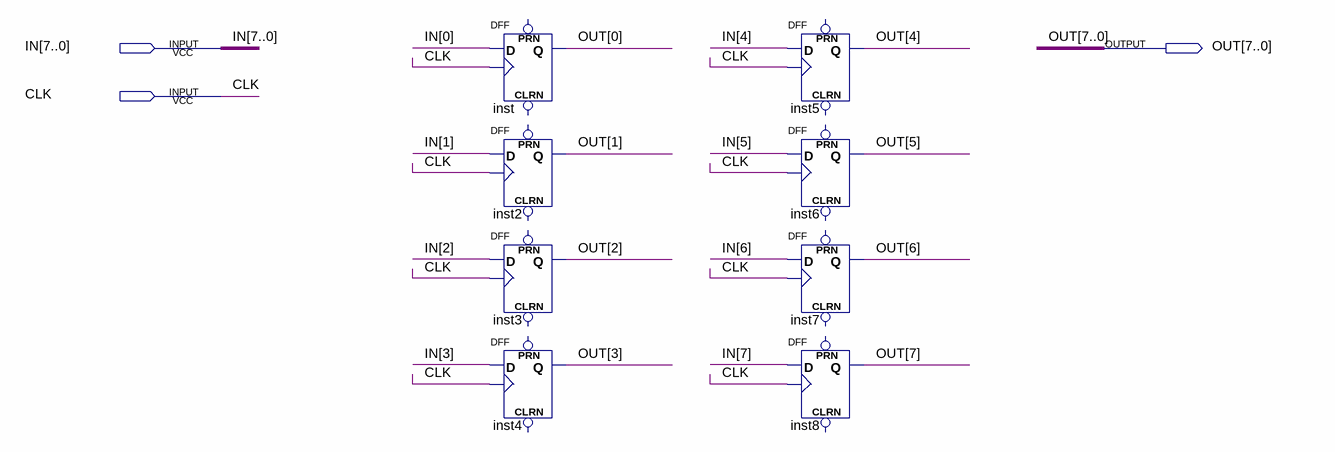
[diagram p0: schematic sheet]
// Quartus schematic reg8bit.bdf as structural Verilog: 8 symbols, 3 pins
module reg8bit (
  input  [7:0] IN,
  input  CLK,
  output [7:0] OUT
);

  DFF inst (.CLK(CLK), .D(IN[0]), .Q(OUT[0]));  // open: CLRN, PRN
  DFF inst2 (.CLK(CLK), .D(IN[1]), .Q(OUT[1]));  // open: CLRN, PRN
  DFF inst3 (.CLK(CLK), .D(IN[2]), .Q(OUT[2]));  // open: CLRN, PRN
  DFF inst4 (.CLK(CLK), .D(IN[3]), .Q(OUT[3]));  // open: CLRN, PRN
  DFF inst5 (.CLK(CLK), .D(IN[4]), .Q(OUT[4]));  // open: CLRN, PRN
  DFF inst6 (.CLK(CLK), .D(IN[5]), .Q(OUT[5]));  // open: CLRN, PRN
  DFF inst7 (.CLK(CLK), .D(IN[6]), .Q(OUT[6]));  // open: CLRN, PRN
  DFF inst8 (.CLK(CLK), .D(IN[7]), .Q(OUT[7]));  // open: CLRN, PRN
endmodule
